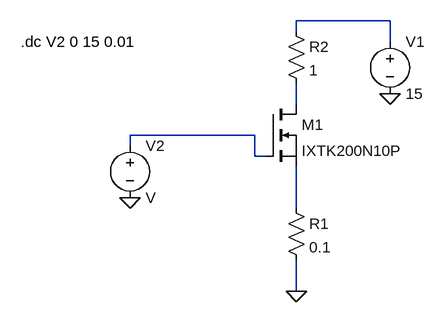
[diagram p0: schematic Draft1.asc]
Draft1.asc, the LTspice schematic file:
Version 4
SHEET 1 880 680
WIRE 576 128 432 128
WIRE 432 144 432 128
WIRE 576 160 576 128
WIRE 432 256 432 224
WIRE 368 304 176 304
WIRE 176 320 176 304
WIRE 368 336 368 304
WIRE 384 336 368 336
WIRE 432 416 432 352
WIRE 432 544 432 496
FLAG 432 544 0
FLAG 576 240 0
FLAG 176 400 0
SYMBOL nmos 384 256 R0
SYMATTR InstName M1
SYMATTR Value IXTK200N10P
SYMBOL Res 416 400 R0
SYMATTR InstName R1
SYMATTR Value 0.1
SYMBOL Res 416 128 R0
SYMATTR InstName R2
SYMATTR Value 1
SYMBOL Voltage 576 144 R0
SYMATTR InstName V1
SYMATTR Value 15
SYMBOL Voltage 176 304 R0
SYMATTR InstName V2
TEXT 8 160 Left 2 !.dc V2 0 15 0.01

The netlist it stands for:
* Draft1.asc
M1 N002 N003 N004 N004 IXTK200N10P
R1 N004 0 0.1
R2 N001 N002 1
V1 N001 0 15
V2 N003 0 V
.model NMOS NMOS
.model PMOS PMOS
.lib standard.mos
.dc V2 0 15 0.01
.backanno
.end